# Altium schematic sheet FlexEMG_v0r0_ACCEL.SchDoc
size A
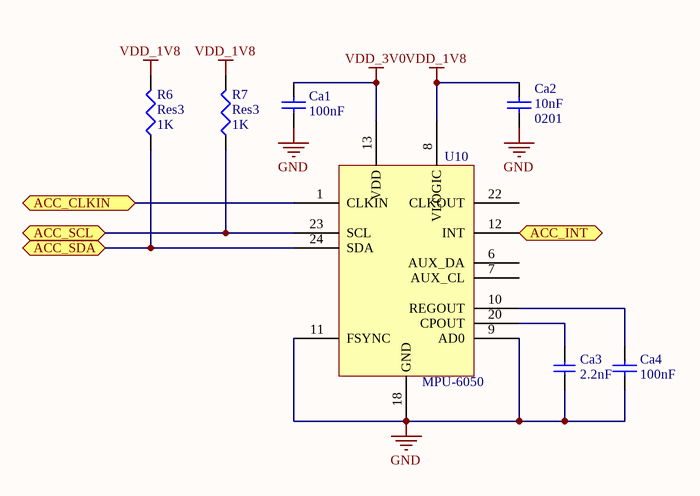
[diagram p0: FlexEMG_v0r0_ACCEL.SchDoc]

## Parts
Ca1  value 100nF  [c0402-Murata-GR]  (hidden comment: GRM155R61H104KE19D)
Ca2  0201  value 10nF  [c0201-Murata-GR]
Ca3  value 2.2nF  [c0402-Murata-GR]
Ca4  value 100nF  [c0402-Murata-GR]  (hidden comment: GRM155R61H104KE19D)
R6  Res3  value 1K  [0402_ss]
R7  Res3  value 1K  [0402_ss]
U10  MPU-6050  [QFN-24]

## Ports
ACC_CLKIN, ACC_INT, ACC_SCL, ACC_SDA

## Nets
GND: Ca1.1 Ca2.1 Ca3.1 Ca4.1 U10.0(CEN) U10.9(AD0) U10.11(FSYNC) U10.18(GND)
VDD_1V8: Ca2.2 R6.2 R7.2 U10.8(VLOGIC)
VDD_3V0: Ca1.2 U10.13(VDD)
ACC_CLKIN: U10.1(CLKIN) ; port ACC_CLKIN
ACC_INT: U10.12(INT) ; port ACC_INT
ACC_SCL: R7.1 U10.23(SCL) ; port ACC_SCL
ACC_SDA: R6.1 U10.24(SDA) ; port ACC_SDA
NetCa3_2: Ca3.2 U10.20(CPOUT)
NetCa4_2: Ca4.2 U10.10(REGOUT)

Not connected (* = marked no-connect by the designer): U10 2(NC) 3(NC) 4(NC) 5(NC) 6(AUX_DA) 7(AUX_CL) 14(NC) 15(NC) 16(NC) 17(NC) 19(RESV) 21(RESV) 22(CLKOUT)

## Library data of the parts
Ca1 Ca4 = Cap: CAP CER 0.1UF 50V X5R 0402; Manufacturer: Murata; Supplier: Digikey; Manufacturer PN: GRM155R61H104KE19D; Supplier PN: 490-11917-1-ND
Ca2 = Cap: CAP CER 10000PF 25V X5R 0201; Manufacturer: Murata; Manufacturer PN: GRM033R61E103KA12D; Supplier: Digikey; Supplier PN: 490-7194-1-ND
Ca3 = CAP_0402: CAP CER 2200PF 50V X7R 0402; Manufacturer: Murata; Manufacturer PN: GRM155R71H222JA01J; Supplier: Digikey; Supplier PN: 490-6359-1-ND
R6 R7 = Res3: Resistor; Published: 8-Jun-2000; LatestRevisionDate: 29-May-2009; LatestRevisionNote: IPC-7351 Footprint Added.; PackageReference: J1-0603; Publisher: Altium Limited; PackageDescription: Chip Resistor
U10 = MPU-6050: GYRO/ACCELEROMETER 6AXIS 24QFN; Manufacturer: InvenSense; Supplier PN: 1428-1007-1-ND; Supplier: Digikey; Manufacturer PN: MPU-6050